# Altium schematic sheet 4 half bridge.SchDoc
size A4; SheetNumber: 4; SheetTotal: 4
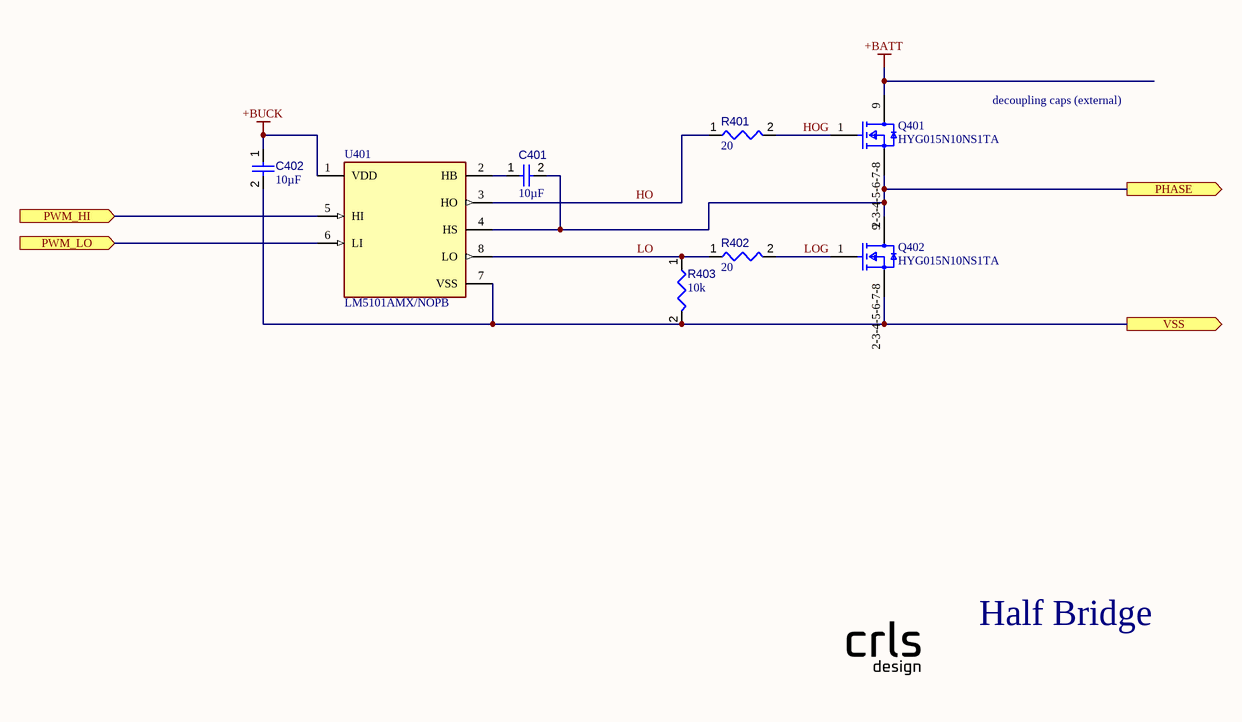
[diagram p0: 4 half bridge.SchDoc]

## Parts
C401  value 10µF  [CAPC0603(1608)100_L]  (hidden comment: Capacitor 10µF +/-20% 10V 0603)
C402  value 10µF  [CAPC0603(1608)100_L]  (hidden comment: Capacitor 10µF +/-20% 10V 0603)
Q401  HYG015N10NS1TA  [FP-PG-HSOF-8-MFG]
Q402  HYG015N10NS1TA  [FP-PG-HSOF-8-MFG]
R401  value 20  [RESC0603(1608)_L]  (hidden comment: Resistor 20R +/-5 % 0603 0.1 W)
R402  value 20  [RESC0603(1608)_L]  (hidden comment: Resistor 20R +/-5 % 0603 0.1 W)
R403  value 10k  [RESC0402(1005)_L]  (hidden comment: Resistor 10K  +/-1 % 0402 63 mW)
U401  LM5101AMX/NOPB  [FP-D0008A-MFG]

## Ports
PHASE (out), PWM_HI (in), PWM_LO (in), VSS (out)

## Nets
+BATT: Q401.9(D)
+BUCK: C402.1 U401.1(VDD)
HO: R401.1 U401.3(HO)
HOG: Q401.1(G) R401.2
LO: R402.1 R403.1 U401.8(LO)
LOG: Q402.1(G) R402.2
PHASE: C401.2 Q401.2-3-4-5-6-7-8(S) Q402.9(D) U401.4(HS) ; port PHASE
PWM_HI: U401.5(HI) ; port PWM_HI
PWM_LO: U401.6(LI) ; port PWM_LO
VSS: C402.2 Q402.2-3-4-5-6-7-8(S) R403.2 U401.7(VSS) ; port VSS
NetC401_1: C401.1 U401.2(HB)

## Notes on the sheet
- decoupling caps (external)
- Half Bridge

## Library data of the parts
C401 C402 = CMP-001-00075-4: Chip Capacitor, 10µF +/-20%, 10V, 0603, Thickness 1 mm; Tolerance: 10%; Voltage Rating: 10V; Max Operating Temperature: 85°C; Pins: 2; Case/Package: 0603; Mounting Technology: SMT; Min Operating Temperature: -55°C
Q401 Q402 = CMP-00196-91542042-1: HYG015N10NS1TA 100V, N-Ch, 1.2 mΩ max, Automotive MOSFET, TOLL, OptiMOS™-5, PG-HSOF-8, RoHS; Max Junction Temperature (Tj): 175°C; Continuous Drain Current (ID): 200A; Turn-Off Delay Time: 30ns; Turn-On Delay Time: 16ns; Drain to Source Voltage (Vdss): 80V; Drain to Source Resistance: 1.8mΩ; Gate to Source Voltage (Vgs): 20V; Power Dissipation: 200W; Number of Channels: 1; NexarPartId: 91542042; Lifecycle Status: Production; Max Operating Temperature: 175°C; Min Operating Temperature: -55°C; Drain to Source Breakdown Voltage: 80V; Manufacturer Package Identifier: PG-HSOF-8; Packaging: Tape & Reel; Package Quantity: 2000; Schedule B: 8541290080, 8541290080; RoHS: Non-Compliant
R401 R402 = CMP-009-00183-1: Chip Resistor, 20 Ohms, +/-5 %, 0.1 W, -55 to 155 degC, 0603; Tolerance: 5%; Power: 100mW; Pins: 2; Max Operating Temperature: 155°C; Case/Package: 0603; Min Operating Temperature: -55°C
R403 = CMP-009-00149-3: Chip Resistor, 10 kOhms, +/-1 %, 63 mW, -55 to 125 degC, 0402; Power: 63mW; Tolerance: 1%; Min Operating Temperature: -55°C; Case/Package: 0402; Max Operating Temperature: 155°C; Pins: 2
U401 = CMP-04912-000094-1: IC GATE DRVR HALF-BRIDGE 8SOIC; Supply Current: 2mA; Number of Channels: 2; Turn-Off Delay Time: 4ns; Min Supply Voltage: 9V; Max Supply Voltage: 14V; Rise Time: 430ns; Propagation Delay: 26ns; Max Output Current: 3A; Quiescent Current: 200uA; Fall Time: 260ns; Series: LM5101A; Number of Outputs: 2; Mount: Surface Mount; RoHS Compliant: Yes; Nominal Supply Current: 2mA; Case/Package: SOIC; Number of Pins: 8; Number of Drivers: 2; Lead Free: Lead Free; Max Operating Temperature: 125°C; Output Current: 3A; Package Quantity: 2500; Radiation Hardening: No; Min Operating Temperature: -40°C; Packaging: Tape and Reel; Turn-On Delay Time: 4ns